# EAGLE design ws2812B (EAGLE 8.0.1)
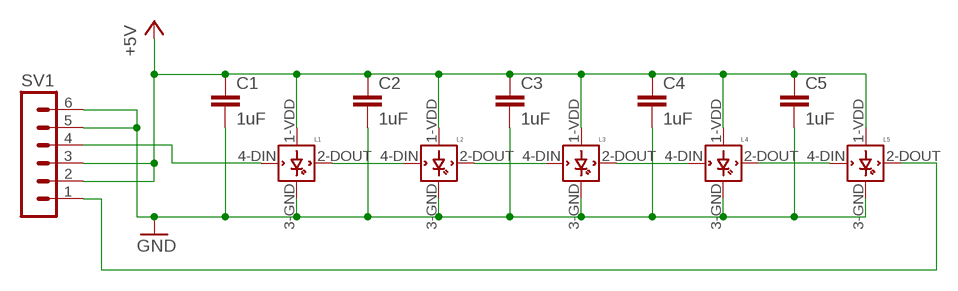
[diagram p0: schematic, sheet 1]

## Parts
C1  1uF  C10/4  [C10B4]
C2  1uF  C10/4  [C10B4]
C3  1uF  C10/4  [C10B4]
C4  1uF  C10/4  [C10B4]
C5  1uF  C10/4  [C10B4]
L1  WS2812B  [WS2812B]
L2  WS2812B  [WS2812B]
L3  WS2812B  [WS2812B]
L4  WS2812B  [WS2812B]
L5  WS2812B  [WS2812B]
SV1  MA06-1  [MA06-1]

## Nets
+5V: C1.1 C2.1 C3.1 C4.1 C5.1 L1.1-VDD(VDD) L2.1-VDD(VDD) L3.1-VDD(VDD) L4.1-VDD(VDD) L5.1-VDD(VDD) SV1.2 SV1.3
GND: C1.2 C2.2 C3.2 C4.2 C5.2 L1.3-GND(GND) L2.3-GND(GND) L3.3-GND(GND) L4.3-GND(GND) L5.3-GND(GND) SV1.5 SV1.6
N$1: L1.4-DIN(DIN) SV1.4
N$2: L4.2-DOUT(DOUT) L5.4-DIN(DIN)
N$3: L5.2-DOUT(DOUT) SV1.1
N$4: L1.2-DOUT(DOUT) L2.4-DIN(DIN)
N$5: L2.2-DOUT(DOUT) L3.4-DIN(DIN)
N$6: L3.2-DOUT(DOUT) L4.4-DIN(DIN)

## Library data of the parts
C1-C5 = capacitor-wima:C: CAPACITOR naming: grid - package width
L1-L5 = adafruit:WS2812B
SV1 = con-lstb:MA06-1: PIN HEADER; OC_FARNELL: unknown; OC_NEWARK: unknown

## Board
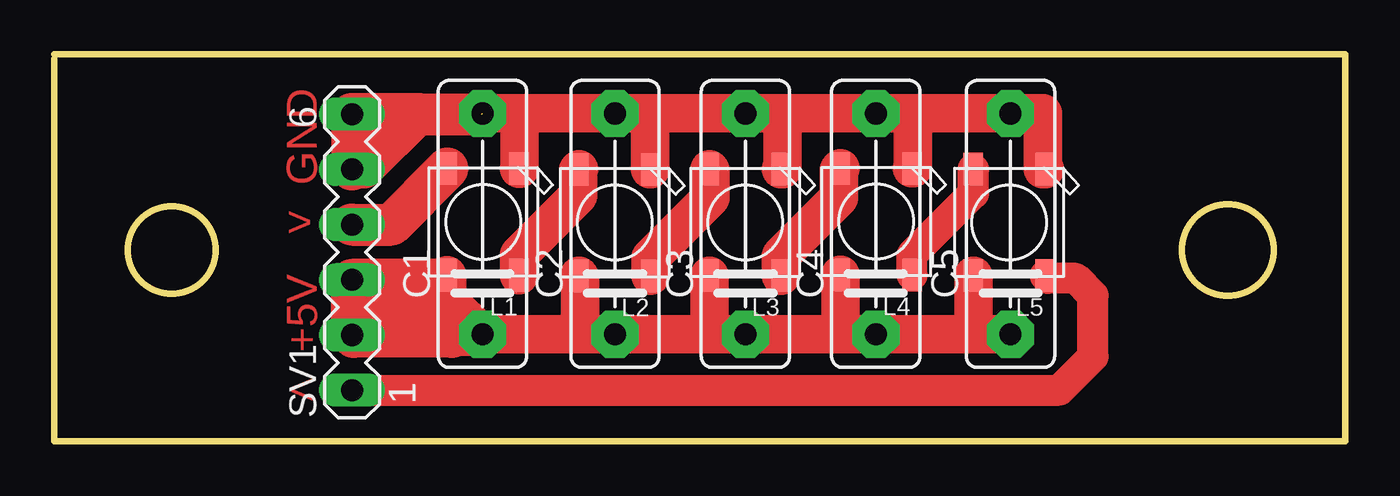
[diagram p1: board, top side]

Size 59.4 x 17.8 mm. Coordinates in mm from the lower left corner, seen from the top.
Outline: 0,17.6 0,0 59.4,0 59.4,17.8 0,17.8
Outline: circle at 54,8.8 radius 2.1
Outline: circle at 5.4,8.8 radius 2
Copper layers (1*16): Top 0.035mm / dielectric 1.5mm / Bottom 0.035mm
Design rules "default": minimum track width 10mil, minimum drill 24mil, track to track 8mil, track to pad 8mil, pad to pad 8mil, via to via 8mil, smd to smd 8mil, copper to edge 40mil, drill to drill 8mil, minimum pad ring 10mil, minimum via ring 8mil, stop-mask expansion 4mil, vias tented up to drill 0mil, thermal gap 10mil

### Footprints (pad centres in the part's own frame; a part is rotated, then mirrored left to right if it is on the bottom)
C10B4 = drill 1.016 pad 2.159 octagon: 1 -5.08,0; 2 5.08,0
WS2812B = smd 1.5 x 0.9: 1-VDD 2.45,-1.65; 2-DOUT 2.45,1.65; 3-GND -2.45,1.65; 4-DIN -2.45,-1.65
MA06-1 = drill 1.016 long: 1 -6.35,0; 2 -3.81,0; 3 -1.27,0; 4 1.27,0; 5 3.81,0; 6 6.35,0

### Placement (x,y rotation side)
C1  19.7,10 90 top
C2  25.8,10 90 top
C3  31.8,10 90 top
C4  37.8,10 90 top
C5  44,10 90 top
L1  19.73,10.09 270 top
L2  25.79,10.05 270 top
L3  31.79,10.07 270 top
L4  37.82,10.1 270 top
L5  43.94,10.07 270 top
SV1  13.7,8.7 90 top

### Tracks (layer width: path | path; a pad name or v marks a point on that pad's centre or on a via)
+5V
  Top 1.778: 30.2,4.92 C2.1 24.2,4.92 | 30.2,4.92 C3.1 36.4,4.92 | 36.4,4.92 C4.1 42.2,4.92 | 42.2,4.92 C5.1 | L3.1-VDD 30.14,4.98 30.2,4.92 | L4.1-VDD 36.17,5.15 36.4,4.92 | 42.2,4.92 42.29,5.01 L5.1-VDD | 18.3,4.8 19.58,4.8 C1.1 | C1.1 24.2,4.92 | 18.3,4.8 18.08,5.02 L1.1-VDD 18.08,6.53 C1.1 | 24.14,4.98 24.2,4.92 | 24.2,4.92 24.2,7.55 L2.1-VDD | 18.3,4.8 16.33,4.8 SV1.3 | SV1.2 15.33,4.89 17.87,7.43
  Top 1.93: 17.87,7.43 SV1.3 SV1.2 13.79,4.8 18.3,4.8
GND  (1 unrouted)
  Top 1.778: 21.4,15.08 C1.2 | 21.4,15.08 C2.2 27.4,15.08 | 27.4,15.08 C3.2 33.5,15.08 | 33.5,15.08 C4.2 39.5,15.08 | 39.5,15.08 C5.2 44,15.1 45.5,15.1 45.5,12.52 L5.3-GND | L1.3-GND 21.4,12.54 21.4,15.08 | L2.3-GND 27.4,12.5 27.4,15.08 | L3.3-GND 33.5,12.52 33.5,15.08 | L4.3-GND 39.5,12.55 39.5,15.08 | SV1.5 14.26,12.51 16.8,15.05
  Top 1.93: SV1.5 SV1.6 16.8,15.05 19.67,15.05
N$1
  Top 1.93: SV1.4 15.51,9.97 L1.4-DIN
N$2
  Top 1.422: L4.2-DOUT 39.47,8.57 42.3,11.4 L5.4-DIN
N$3
  Top 1.422: SV1.1 46.25,2.35 47.8,3.9 47.8,6.7 47,7.5 45.71,7.5 L5.2-DOUT
N$4
  Top 1.778: L1.2-DOUT 21.39,8.59 24.1,11.3 24.1,12.46 L2.4-DIN
N$5
  Top 1.778: L2.2-DOUT 27.44,8.44 30.2,11.2 30.2,12.46 L3.4-DIN
N$6
  Top 1.778: L3.2-DOUT 33.44,8.55 36.1,11.2 36.1,12.48 L4.4-DIN

### Text on the board
Top: GND | > | +5V | <